# Altium schematic sheet CAN.SchDoc
size A4; SheetNumber: 7; SheetTotal: 9
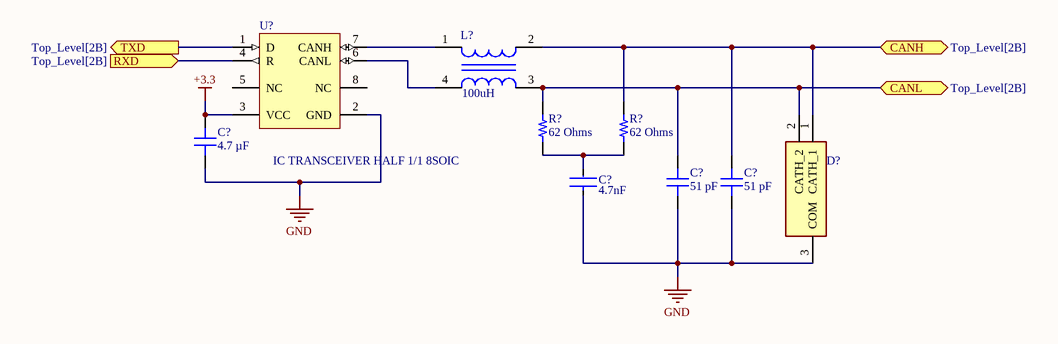
[diagram p0: CAN.SchDoc]

## Parts
(Parts that share a designator on the sheet are numbered #1, #2 ... from top to bottom, then left to right.)
C?#1  4.7 µF  [CAP 0603_1608]
C?#2  value 4.7nF  [FP-CGA3E-0_3-0_1-IPC_C]  (hidden comment: CER 4700PF 50V C0G 0603)
C?#3  51 pF  [CAP 0603_1608]
C?#4  51 pF  [CAP 0603_1608]
D?  TVS DIODE 24VWM 70VC TO236AB  [SOT95P230X110-3N]  (value not drawn)
L?  value 100uH  [FP-B82789C0-MFG]  (hidden comment: CMC 100UH 150MA 2LN SMD AEC-Q200)
R?#1  62 Ohms  [RES 1206_3216]
R?#2  62 Ohms  [RES 1206_3216]
U?  IC TRANSCEIVER HALF 1/1 8SOIC  [D0008A_M]

## Ports
CANH (bidir, see Top_Level[2B]), CANL (bidir, see Top_Level[2B]), RXD (in, see Top_Level[2B]), TXD (out, see Top_Level[2B])

## Nets
+3.3: C?#1.2 U?.3(VCC)
GND: C?#1.1 C?#2.1 C?#3.1 C?#4.1 D?.3(COM) U?.2(GND)
CANH: C?#4.2 D?.1(CATH_1) L?.2 R?#2.2 ; port CANH
CANL: C?#3.2 D?.2(CATH_2) L?.3 R?#1.2 ; port CANL
RXD: U?.4(R) ; port RXD
TXD: U?.1(D) ; port TXD
NetC?#2_2: C?#2.2 R?#1.1 R?#2.1
NetL?_1: L?.1 U?.7(CANH)
NetL?_4: L?.4 U?.6(CANL)

Not connected (* = marked no-connect by the designer): U? 5(NC) 8(NC)

## Library data of the parts
C?#1 = CGA3E1X5R0J475K080AC: CAP CER 4.7UF 6.3V X5R 0603; manufacturer: TDK Corporation; Tolerance: ±10%; Part Number: CGA3E1X5R0J475K080AC; Value: 4.7 µF; Applications: Automotive; Capacitance: 4.7 µF; componentlink1description: Datasheet; componentlink1url: https://product.tdk.com/info/en/catalog/datasheets/mlcc_automotive_general_en.pdf?ref_disty=digikey; componentlink2description: DigiKey Link; componentlink2url: https://www.digikey.com/en/products/detail/tdk-corporation/CGA3E1X5R0J475K080AC/2672827; Device Package: 0603 (1608 Metric); lastupdated: 2023-06-04 7:11:06 PM; Lifecycle Status: Active; Minimum Order: 1; Mounting Type: Surface Mount, MLCC; Operating Temperature: -55°C ~ 85°C; Package / Case: 0603 (1608 Metric); packaging: TapeAndReel; partid: 12825; Part Status: Active; price: 0.05; Ratings: AEC-Q200; series: CGA; Size / Dimension: 0.063" L x 0.031" W (1.60mm x 0.80mm); Supplier 1: DigiKey; Supplier Part Number 1: 445-6934-1-ND; Temperature Coefficient: X5R; Thickness (Max): 0.035" (0.90mm); Voltage - Rated: 6.3V
C?#2 = CGA3E2C0G1H472J080AA: CAP CER 4700PF 50V C0G 0603; Manufacturer: TDK; Dielectric Material: Ceramic; Multilayer: Yes; Tolerance  (fill in as +-): 5%; Reference Standard: AEC-Q200; Supplier: Digi-Key; Supplier Part Number: 445-6912-1-ND; Manufacturer Part Number: CGA3E2C0G1H472J080AA; RoHS: Yes; Category: Ceramic Capacitors; Stock: 784111; Pricing: 1=0.22, 10=0.152, 50=0.101, 100=0.0858, 500=0.0606, 1000=0.05302 (USD); Mounting Technology: Surface Mount; Pins: 2; Package Shape: Rectangular; Case/Package: 0603; Terminal Finish: Nickel; Min Operating Temperature: -55°C; Max Operating Temperature: 125°C; JESD-609 Code: e3; Capacitor Type: Ceramic; Package Style: SMTMeter; Packaging: Tape and Reel; Tolerance (fill in as +-): 5%; Rated DC Voltage (URdc): 50V; Temperature Characteristics Code: C0G; Termination: Wraparound; Length: 1.6mm; Width: 0.8mm; Height: 0.8mm; Reach SVHC Compliant: Yes; RoHS Compliant: Yes; ComponentLink1URL: https://datasheet.ciiva.com:443/pdfs/VipMasterIC/IC/TDKC/TDKC-S-A0008953915/TDKC-S-A0008953915-1.pdf?src-supplier=IHS+Markit; ComponentLink1Description: https://datasheet.ciiva.com:443/pdfs/VipMasterIC/IC/TDKC/TDKC-S-A0008953915/TDKC-S-A0008953915-1.pdf?src-supplier=IHS+Markit; ComponentLink2URL: https://datasheet.ciiva.com/24217/mlcc-automotive-general-en-24217054.pdf?src-supplier=Mouser; ComponentLink2Description: https://datasheet.ciiva.com/24217/mlcc-automotive-general-en-24217054.pdf?src-supplier=Mouser; ComponentLink3URL: https://datasheet.ciiva.com/6149/1807242-6149350.pdf?src-supplier=Farnell; ComponentLink3Description: https://datasheet.ciiva.com/6149/1807242-6149350.pdf?src-supplier=Farnell; ComponentLink4URL: https://datasheet.ciiva.com/7975/1807242-7975303.pdf?src-supplier=Element14; ComponentLink4Description: https://datasheet.ciiva.com/7975/1807242-7975303.pdf?src-supplier=Element14
C?#3 C?#4 = CC0603JRNPO9BN510: CAP CER 51PF 50V C0G/NPO 0603; manufacturer: Yageo; Temperature Coefficient: C0G, NP0; Tolerance: ±5%; Part Number: CC0603JRNPO9BN510; Value: 51 pF; Applications: General Purpose; Capacitance: 51 pF; componentlink1description: Datasheet; componentlink1url: https://www.yageo.com/upload/media/product/productsearch/datasheet/mlcc/UPY-GP_NP0_16V-to-50V_17.pdf; componentlink2description: DigiKey Link; componentlink2url: https://www.digikey.com/en/products/detail/yageo/CC0603JRNPO9BN510/5883618; Device Package: 0603 (1608 Metric); lastupdated: 2023-06-04 7:11:29 PM; Lifecycle Status: Active; Minimum Order: 1; Mounting Type: Surface Mount, MLCC; Operating Temperature: -55°C ~ 125°C; Package / Case: 0603 (1608 Metric); packaging: TapeAndReel; partid: 3610; Part Status: Active; price: 0.01; series: CC; Size / Dimension: 0.063" L x 0.031" W (1.60mm x 0.80mm); Supplier 1: DigiKey; Supplier Part Number 1: 311-3358-1-ND; Thickness (Max): 0.035" (0.90mm); Voltage - Rated: 50V
D? = PESD1CAN,215: Trans Voltage Suppressor Diode, 200W, 24V V(RWM), Bidirectional, 2 Element, Silicon, TO-236AB; Manufacturer: Nexperia; Package Body Material: Plastic; Max Breakdown Voltage: 30.3V; Min Breakdown Voltage: 25.4V; Number of Elements: 2; Time @ Peak Reflow Temperature-Max (s): 40s; Reference Standard: IEC-60134; Qualification Status: Not Qualified; Supplier: Digi-Key; Supplier Part Number: 1727-3817-1-ND; Manufacturer Part Number: PESD1CAN,215; RoHS: Yes; Category: ESD and Circuit Protection ICs; Stock: 102526; Pricing: 1=0.45, 10=0.366, 100=0.2492, 500=0.18688, 1000=0.14016 (USD); Pins: 3; Diode Element Material: SILICON; Package Shape: Rectangular; Terminal Finish: Tin; Max Operating Temperature: 150°C; Polarity: Bidirectional; Diode Type: TRANS VOLTAGE SUPPRESSOR; JESD-30 Code: R-PDSO-G3; Non-rep Peak Rev Power Dis-Max: 200W; Package Style: SMALL OUTLINEMeter; Rep Pk Reverse Voltage-Max: 24V; Surface Mount: Yes; Technology: AVALANCHE; Terminal Form: Gull Wing; Terminal Position: DUAL; JESD-609 Code: e3; Moisture Sensitivity Level: 1; Peak Reflow Temperature (Cel): 260°C; Reach SVHC Compliant: Yes; RoHS Compliant: Yes; JEDEC-95 Code: TO-236AB; ComponentLink1URL: https://datasheet.ciiva.com:443/pdfs/VipMasterIC/IC/NEXP/NEXP-S-A0005722386/NEXP-S-A0005722386-1.pdf?src-supplier=IHS+Markit; ComponentLink1Description: https://datasheet.ciiva.com:443/pdfs/VipMasterIC/IC/NEXP/NEXP-S-A0005722386/NEXP-S-A0005722386-1.pdf?src-supplier=IHS+Markit; ComponentLink2URL: http://www.farnell.com/datasheets/109497.pdf?src-supplier=Farnell; ComponentLink2Description: http://www.farnell.com/datasheets/109497.pdf?src-supplier=Farnell; ComponentLink3URL: https://assets.nexperia.com/documents/data-sheet/PESD1CAN.pdf?src-supplier=Digi-Key; ComponentLink3Description: https://assets.nexperia.com/documents/data-sheet/PESD1CAN.pdf?src-supplier=Digi-Key; ComponentLink4URL: http://www.farnell.com/datasheets/109497.pdf?src-supplier=Newark; ComponentLink4Description: http://www.farnell.com/datasheets/109497.pdf?src-supplier=Newark
L? = B82789C0104N002: Manufacturer: TDK EPCOS; DC Resistance-Max: 1.5R; Filter Type: DATA LINE FILTER; Channels: 2; Output Impedance: 50R; Voltage Rating: 80V; Supplier: Digi-Key; Supplier Part Number: 495-5751-1-ND; Manufacturer Part Number: B82789C0104N002; RoHS: Yes; Category: Fixed Inductors; Stock: 40158; Pricing: 1=1.7, 10=1.571, 25=1.44, 50=1.2304, 100=1.0995, 250=0.94244, 500=0.8901, 1000=0.81156 (USD); Mounting Technology: Surface Mount; Terminal Finish: Tin; Min Operating Temperature: -55°C; Max Operating Temperature: 125°C; JESD-609 Code: e3; Manufacturer Series: B82789C0; Packaging: Tape and Reel; Current Rating: 150mA; Length: 4.5mm; Height: 3mm; Reach SVHC Compliant: Yes; RoHS Compliant: Yes; ComponentLink1URL: https://datasheet.ciiva.com:443/pdfs/VipMasterIC/IC/TDKC/TDKC-S-A0008970033/TDKC-S-A0008970033-1.pdf?src-supplier=IHS+Markit; ComponentLink1Description: https://datasheet.ciiva.com:443/pdfs/VipMasterIC/IC/TDKC/TDKC-S-A0008970033/TDKC-S-A0008970033-1.pdf?src-supplier=IHS+Markit; ComponentLink2URL: https://datasheet.ciiva.com/22684/1899203-22684429.pdf?src-supplier=Element14; ComponentLink2Description: https://datasheet.ciiva.com/22684/1899203-22684429.pdf?src-supplier=Element14
R?#1 R?#2 = ERJ-P08J620V: RES SMD 62 OHM 5% 2/3W 1206; Manufacturer: Panasonic Electronic Components; Power (Watts): 0.667W, 2/3W; Temperature Coefficient: ±200ppm/°C; Part Number: ERJ-P08J620V; ComponentLink1Description: Datasheet; ComponentLink1URL: https://industrial.panasonic.com/cdbs/www-data/pdf/RDO0000/AOA0000C331.pdf; ComponentLink2Description: DigiKey Link; ComponentLink2URL: https://www.digikey.com/en/products/detail/panasonic-electronic-components/ERJ-P08J620V/525410; Composition: Thick Film; Device Package: 1206 (3216 Metric); Features: Automotive AEC-Q200, Pulse Withstanding; Height - Seated (Max): 0.028" (0.70mm); LastUpdated: 2023-06-03 7:49:04 PM; Lifecycle Status: Active; Minimum Order: 1; Number of Terminations: 2; Operating Temperature: -55°C ~ 155°C; Package / Case: 1206 (3216 Metric); Packaging: TapeAndReel; PartId: 32942; Part Status: Active; Price: 0.02; Ratings: AEC-Q200; Resistance: 62 Ohms; Series: ERJ-P08; Size / Dimension: 0.126" L x 0.063" W (3.20mm x 1.60mm); Supplier 1: DigiKey; Supplier Part Number 1: P62ALCT-ND; Supplier Device Package: 1206; Tolerance: ±5%; Value: 62 Ohms
U? = SN65HVD232DR: Manufacturer: Texas Instruments; Package Body Material: Plastic; Data Rate: 1000Mbps; Channels: 1; Package Equivalence Code: SOP8,.25; Power Supplies: 3.3V; Max Supply Current: 17uA; Telecom IC Type: INTERFACE CIRCUIT; Qualification Status: Not Qualified; Supplier: Digi-Key; Supplier Part Number: 296-26344-1-ND; Manufacturer Part Number: SN65HVD232DR; RoHS: Yes; Category: Interface ICs; Stock: 38986; Pricing: 1=2.55, 10=2.29, 25=2.1604, 100=1.8407, 250=1.72832, 500=1.5123, 1000=1.25305 (USD); Case/Package: SOP; Pins: 8; Package Shape: Rectangular; Terminal Finish: Nickel; Min Operating Temperature: -40°C; Max Operating Temperature: 85°C; JESD-609 Code: e4; JESD-30 Code: R-PDSO-G8; Moisture Sensitivity Level: 1; Number of Transceivers: 1; Package Style: SMALL OUTLINEMeter; Peak Reflow Temperature (Cel): 260°C; Nominal Supply Voltage: 3.3V; Surface Mount: Yes; Technology: BICMOS; Terminal Form: Gull Wing; Terminal Position: DUAL; Length: 4.9mm; Width: 3.9mm; Height - Seated (Max): 1.75mm; Terminal Pitch: 1.27mm; Temperature Grade: INDUSTRIAL; Reach SVHC Compliant: Yes; RoHS Compliant: Yes; ComponentLink1URL: https://www.ti.com:443/lit/ds/symlink/sn65hvd230.pdf?src-supplier=IHS+Markit; ComponentLink1Description: https://www.ti.com:443/lit/ds/symlink/sn65hvd230.pdf?src-supplier=IHS+Markit; ComponentLink2URL: https://datasheet.ciiva.com/1771/sn65hvd230-1771113.pdf?src-supplier=Digi-Key; ComponentLink2Description: https://datasheet.ciiva.com/1771/sn65hvd230-1771113.pdf?src-supplier=Digi-Key; ComponentLink3URL: https://datasheet.ciiva.com/1771/sn65hvd230-1771112.pdf?src-supplier=Digi-Key; ComponentLink3Description: https://datasheet.ciiva.com/1771/sn65hvd230-1771112.pdf?src-supplier=Digi-Key; ComponentLink4URL: https://datasheet.ciiva.com/1771/sn65hvd230-1771114.pdf?src-supplier=Digi-Key; ComponentLink4Description: https://datasheet.ciiva.com/1771/sn65hvd230-1771114.pdf?src-supplier=Digi-Key; ComponentLink5URL: https://datasheet.ciiva.com/15149/getdatasheetpartid-107534-15149958.pdf?src-supplier=Verical; ComponentLink5Description: https://datasheet.ciiva.com/15149/getdatasheetpartid-107534-15149958.pdf?src-supplier=Verical